# Altium schematic sheet 12_MEM_DDR3.SchDoc
size A3; DocumentNumber: 12; SheetNumber: 12; SheetTotal: 21
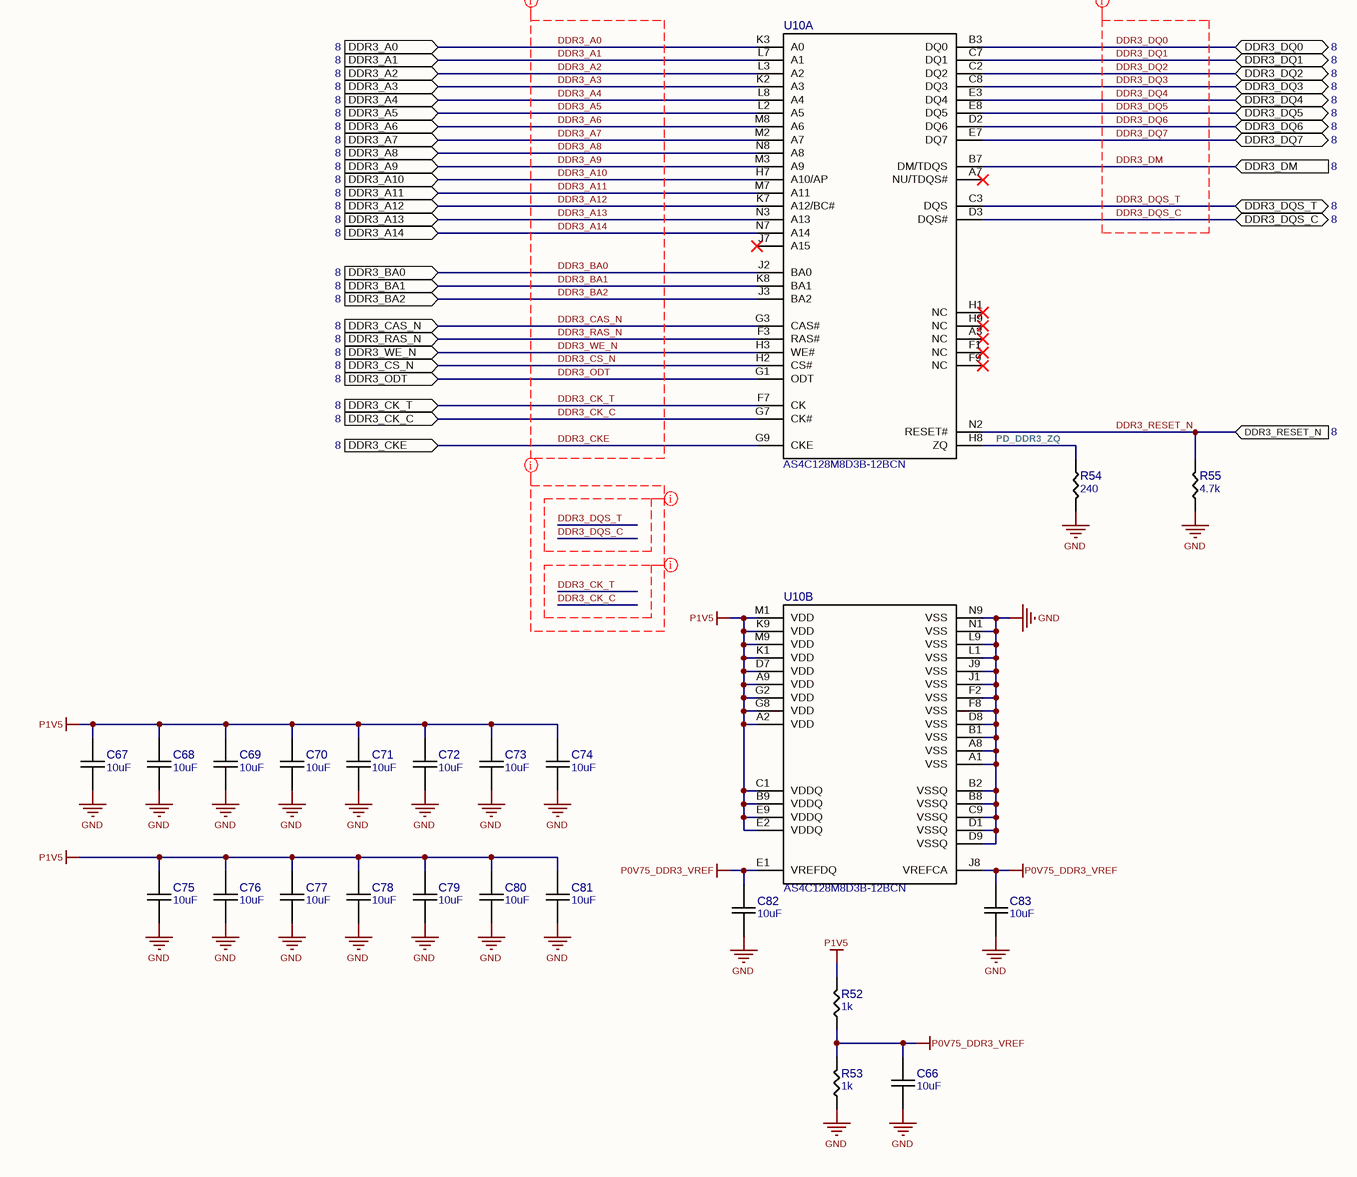
[diagram p0: 12_MEM_DDR3.SchDoc]

## Parts
C66  10uF  [CAPC1005X06N]
C67  10uF  [CAPC1005X06N]
C68  10uF  [CAPC1005X06N]
C69  10uF  [CAPC1005X06N]
C70  10uF  [CAPC1005X06N]
C71  10uF  [CAPC1005X06N]
C72  10uF  [CAPC1005X06N]
C73  10uF  [CAPC1005X06N]
C74  10uF  [CAPC1005X06N]
C75  10uF  [CAPC1005X06N]
C76  10uF  [CAPC1005X06N]
C77  10uF  [CAPC1005X06N]
C78  10uF  [CAPC1005X06N]
C79  10uF  [CAPC1005X06N]
C80  10uF  [CAPC1005X06N]
C81  10uF  [CAPC1005X06N]
C82  10uF  [CAPC1005X06N]
C83  10uF  [CAPC1005X06N]
R52  1k  [RESC1005X03N]
R53  1k  [RESC1005X03N]
R54  240  [RESC1005X03N]
R55  4.7k  [RESC1005X03N]
U10  AS4C128M8D3B-12BCN  [BGA78C80P9X13_800X1050X100]  (parts A,B of 2)

## Ports
DDR3_A0 (in, see 8), DDR3_A1 (in, see 8), DDR3_A2 (in, see 8), DDR3_A3 (in, see 8), DDR3_A4 (in, see 8), DDR3_A5 (in, see 8), DDR3_A6 (in, see 8), DDR3_A7 (in, see 8), DDR3_A8 (in, see 8), DDR3_A9 (in, see 8), DDR3_A10 (in, see 8), DDR3_A11 (in, see 8), DDR3_A12 (in, see 8), DDR3_A13 (in, see 8), DDR3_A14 (in, see 8), DDR3_BA0 (in, see 8), DDR3_BA1 (in, see 8), DDR3_BA2 (in, see 8), DDR3_CAS_N (in, see 8), DDR3_CK_C (in, see 8), DDR3_CK_T (in, see 8), DDR3_CKE (in, see 8), DDR3_CS_N (in, see 8), DDR3_DM (in, see 8), DDR3_DQ0 (bidir, see 8), DDR3_DQ1 (bidir, see 8), DDR3_DQ2 (bidir, see 8), DDR3_DQ3 (bidir, see 8), DDR3_DQ4 (bidir, see 8), DDR3_DQ5 (bidir, see 8), DDR3_DQ6 (bidir, see 8), DDR3_DQ7 (bidir, see 8), DDR3_DQS_C (bidir, see 8), DDR3_DQS_T (bidir, see 8), DDR3_ODT (in, see 8), DDR3_RAS_N (in, see 8), DDR3_RESET_N (in, see 8), DDR3_WE_N (in, see 8)

## Nets
GND: C66.1 C67.1 C68.1 C69.1 C70.1 C71.1 C72.1 C73.1 C74.1 C75.1 C76.1 C77.1 C78.1 C79.1 C80.1 C81.1 C82.1 C83.1 R53.1 R54.2 R55.1 U10.A1(VSS) U10.A8(VSS) U10.B1(VSS) U10.B2(VSSQ) U10.B8(VSSQ) U10.C9(VSSQ) U10.D1(VSSQ) U10.D8(VSS) U10.D9(VSSQ) U10.F2(VSS) U10.F8(VSS) U10.J1(VSS) U10.J9(VSS) U10.L1(VSS) U10.L9(VSS) U10.N1(VSS) U10.N9(VSS)
P0V75_DDR3_VREF: C66.2 C82.2 C83.2 R52.1 R53.2 U10.E1(VREFDQ) U10.J8(VREFCA)
P1V5: C67.2 C68.2 C69.2 C70.2 C71.2 C72.2 C73.2 C74.2 C75.2 C76.2 C77.2 C78.2 C79.2 C80.2 C81.2 R52.2 U10.A2(VDD) U10.A9(VDD) U10.B9(VDDQ) U10.C1(VDDQ) U10.D7(VDD) U10.E2(VDDQ) U10.E9(VDDQ) U10.G2(VDD) U10.G8(VDD) U10.K1(VDD) U10.K9(VDD) U10.M1(VDD) U10.M9(VDD)
DDR3_A0: U10.K3(A0) ; port DDR3_A0
DDR3_A1: U10.L7(A1) ; port DDR3_A1
DDR3_A2: U10.L3(A2) ; port DDR3_A2
DDR3_A3: U10.K2(A3) ; port DDR3_A3
DDR3_A4: U10.L8(A4) ; port DDR3_A4
DDR3_A5: U10.L2(A5) ; port DDR3_A5
DDR3_A6: U10.M8(A6) ; port DDR3_A6
DDR3_A7: U10.M2(A7) ; port DDR3_A7
DDR3_A8: U10.N8(A8) ; port DDR3_A8
DDR3_A9: U10.M3(A9) ; port DDR3_A9
DDR3_A10: U10.H7(A10/AP) ; port DDR3_A10
DDR3_A11: U10.M7(A11) ; port DDR3_A11
DDR3_A12: U10.K7(A12/BC#) ; port DDR3_A12
DDR3_A13: U10.N3(A13) ; port DDR3_A13
DDR3_A14: U10.N7(A14) ; port DDR3_A14
DDR3_BA0: U10.J2(BA0) ; port DDR3_BA0
DDR3_BA1: U10.K8(BA1) ; port DDR3_BA1
DDR3_BA2: U10.J3(BA2) ; port DDR3_BA2
DDR3_CAS_N: U10.G3(CAS#) ; port DDR3_CAS_N
DDR3_CK_C: U10.G7(CK#) ; port DDR3_CK_C
DDR3_CK_T: U10.F7(CK) ; port DDR3_CK_T
DDR3_CKE: U10.G9(CKE) ; port DDR3_CKE
DDR3_CS_N: U10.H2(CS#) ; port DDR3_CS_N
DDR3_DM: U10.B7(DM/TDQS) ; port DDR3_DM
DDR3_DQ0: U10.B3(DQ0) ; port DDR3_DQ0
DDR3_DQ1: U10.C7(DQ1) ; port DDR3_DQ1
DDR3_DQ2: U10.C2(DQ2) ; port DDR3_DQ2
DDR3_DQ3: U10.C8(DQ3) ; port DDR3_DQ3
DDR3_DQ4: U10.E3(DQ4) ; port DDR3_DQ4
DDR3_DQ5: U10.E8(DQ5) ; port DDR3_DQ5
DDR3_DQ6: U10.D2(DQ6) ; port DDR3_DQ6
DDR3_DQ7: U10.E7(DQ7) ; port DDR3_DQ7
DDR3_DQS_C: U10.D3(DQS#) ; port DDR3_DQS_C
DDR3_DQS_T: U10.C3(DQS) ; port DDR3_DQS_T
DDR3_ODT: U10.G1(ODT) ; port DDR3_ODT
DDR3_RAS_N: U10.F3(RAS#) ; port DDR3_RAS_N
DDR3_RESET_N: R55.2 U10.N2(RESET#) ; port DDR3_RESET_N
DDR3_WE_N: U10.H3(WE#) ; port DDR3_WE_N
PD_DDR3_ZQ: R54.1 U10.H8(ZQ)

Not connected (* = marked no-connect by the designer): U10 A3(NC)* A7(NU/TDQS#)* F1(NC)* F9(NC)* H1(NC)* H9(NC)* J7(A15)*

## Layout directives
net class DDR3_DQ: DDR3_DM, DDR3_DQ0, DDR3_DQ1, DDR3_DQ2, DDR3_DQ3, DDR3_DQ4, DDR3_DQ5, DDR3_DQ6, DDR3_DQ7, DDR3_DQS_C, DDR3_DQS_T
net class DDR3_CA: DDR3_A0, DDR3_A1, DDR3_A2, DDR3_A3, DDR3_A4, DDR3_A5, DDR3_A6, DDR3_A7, DDR3_A8, DDR3_A9, DDR3_A10, DDR3_A11, DDR3_A12, DDR3_A13, DDR3_A14, DDR3_BA0, DDR3_BA1, DDR3_BA2, DDR3_CAS_N, DDR3_CK_C, DDR3_CK_T, DDR3_CKE, DDR3_CS_N, DDR3_ODT, DDR3_RAS_N, DDR3_WE_N
net class DDR3_DQS: DDR3_DQS_C, DDR3_DQS_T
net class DDR3_CK: DDR3_CK_C, DDR3_CK_T
net class DDR3_CLK: DDR3_CK_C, DDR3_CK_T, DDR3_DQS_C, DDR3_DQS_T

## Library data of the parts
C66-C83 = GRM155R60J106ME47D: CAP CER 10UF 6.3V X5R 0402; Manufacturer 1: Murata Electronics; Tol: 20%; Part Number: GRM155R60J106ME47D; Value: 10uF; Voltage: 6.3V; TempC: X5R; Manufacturer Part Number 1: GRM155R60J106ME47D; Supplier 1: Digi-Key; Supplier Part Number 1: 490-13239-1-ND
R52 R53 = RC0402FR-071KL: RES SMD 1K OHM 1% 1/16W 0402; Manufacturer 1: Yageo; Part Number: RC0402FR-071KL; Value: 1k; Tol: 1%; Manufacturer Part Number 1: RC0402FR-071KL; Supplier 1: Digi-Key; Supplier Part Number 1: 311-1.00KLRCT-ND
R54 = RC0402FR-07240RL: RES SMD 240 OHM 1% 1/16W 0402; Manufacturer 1: Yageo; Part Number: RC0402FR-07240RL; Value: 240; Tol: 1%; Manufacturer Part Number 1: RC0402FR-07240RL; Supplier 1: Digi-Key; Supplier Part Number 1: 311-240LRCT-ND
R55 = RC0402FR-074K7L: RES SMD 4.7K OHM 1% 1/16W 0402; Manufacturer 1: Yageo; Part Number: RC0402FR-074K7L; Value: 4.7k; Tol: 1%; Manufacturer Part Number 1: RC0402FR-074K7L; Supplier 1: Digi-Key; Supplier Part Number 1: 311-4.7KLRCT-ND
U10 = AS4C128M8D3B-12BCN: IC DRAM 1GBIT PARALLEL 78FBGA; Manufacturer 1: Alliance Memory, Inc.; Part Number: AS4C128M8D3B-12BCN; Manufacturer Part Number 1: AS4C128M8D3B-12BCN; Supplier 1: Digi-Key; Supplier Part Number 1: 1450-1447-ND